# EasyEDA Pro project ProPrj_STM L_2026-07-04.epro, board PCB1
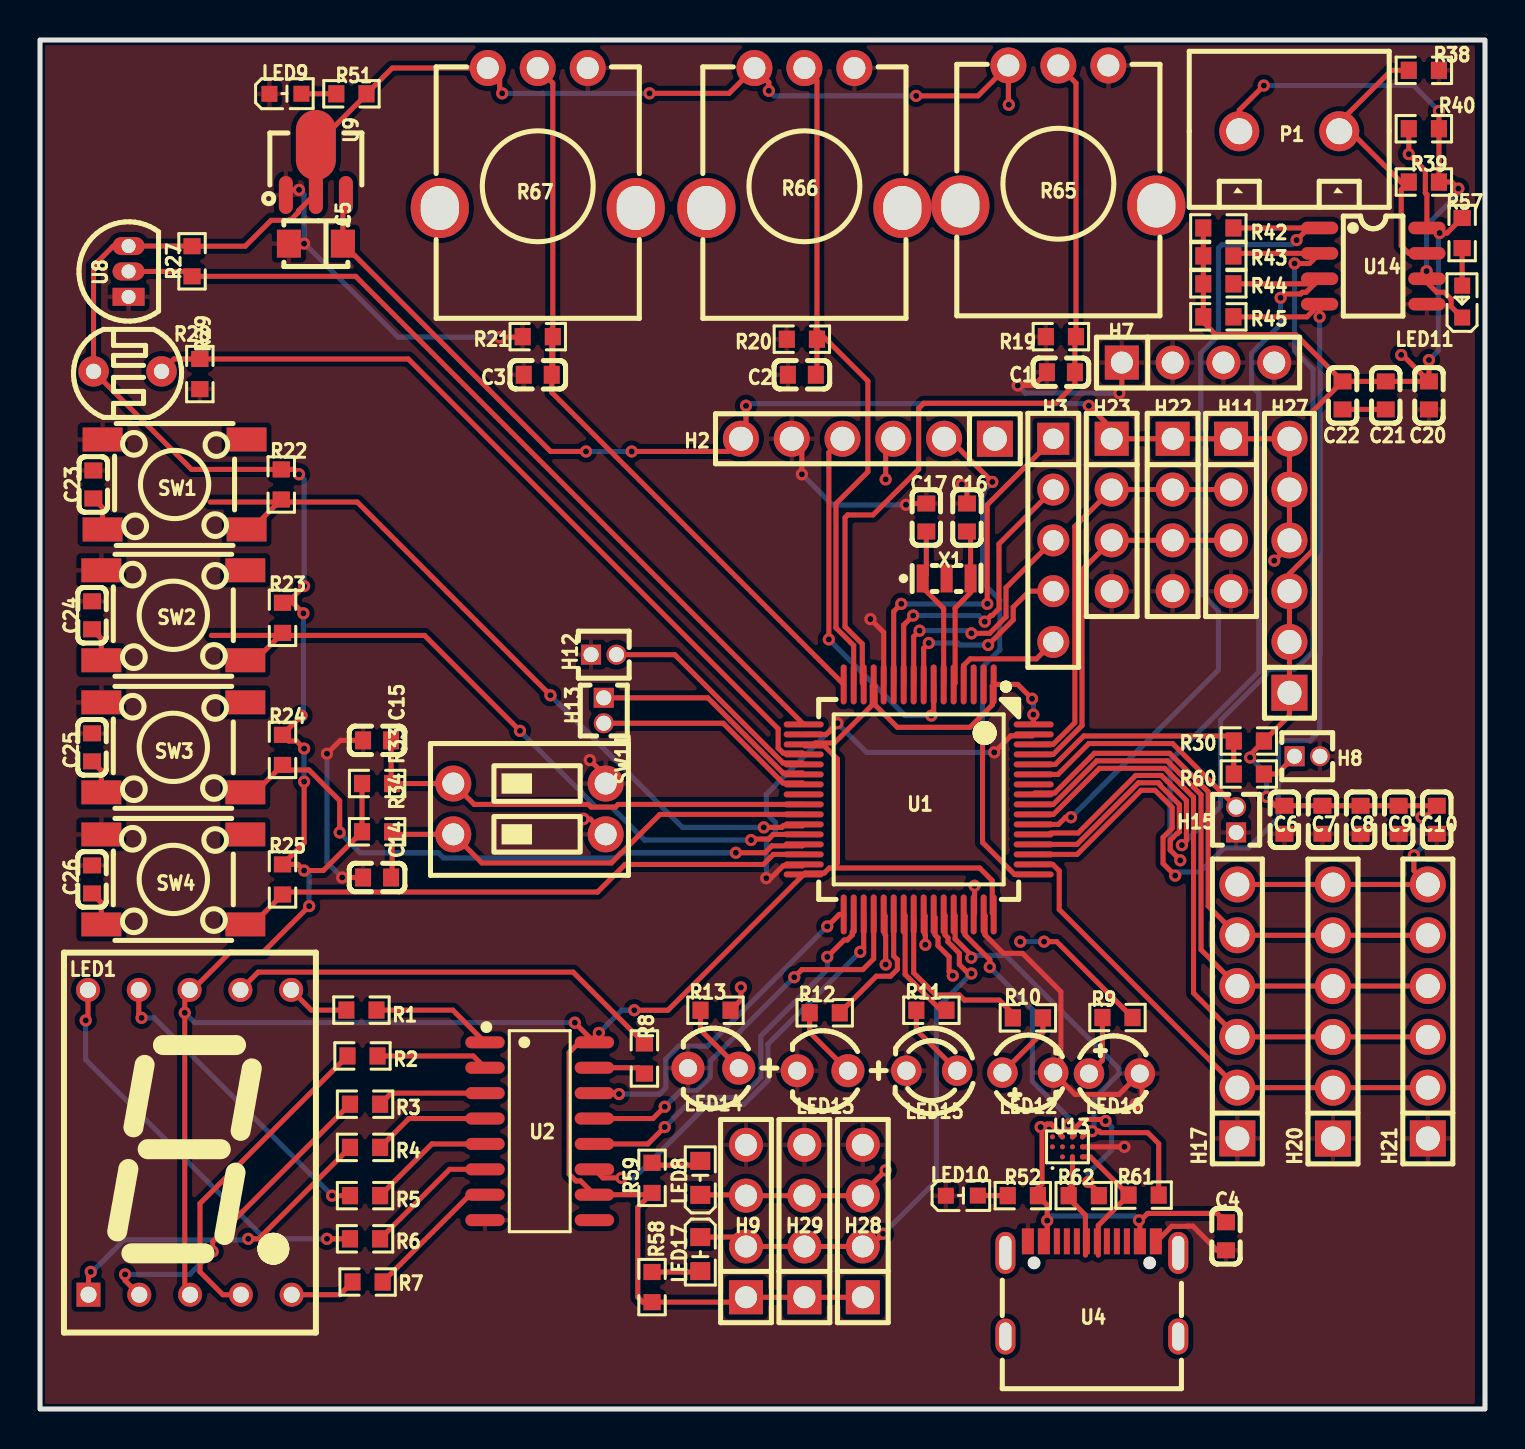
[diagram p1: board, top side]
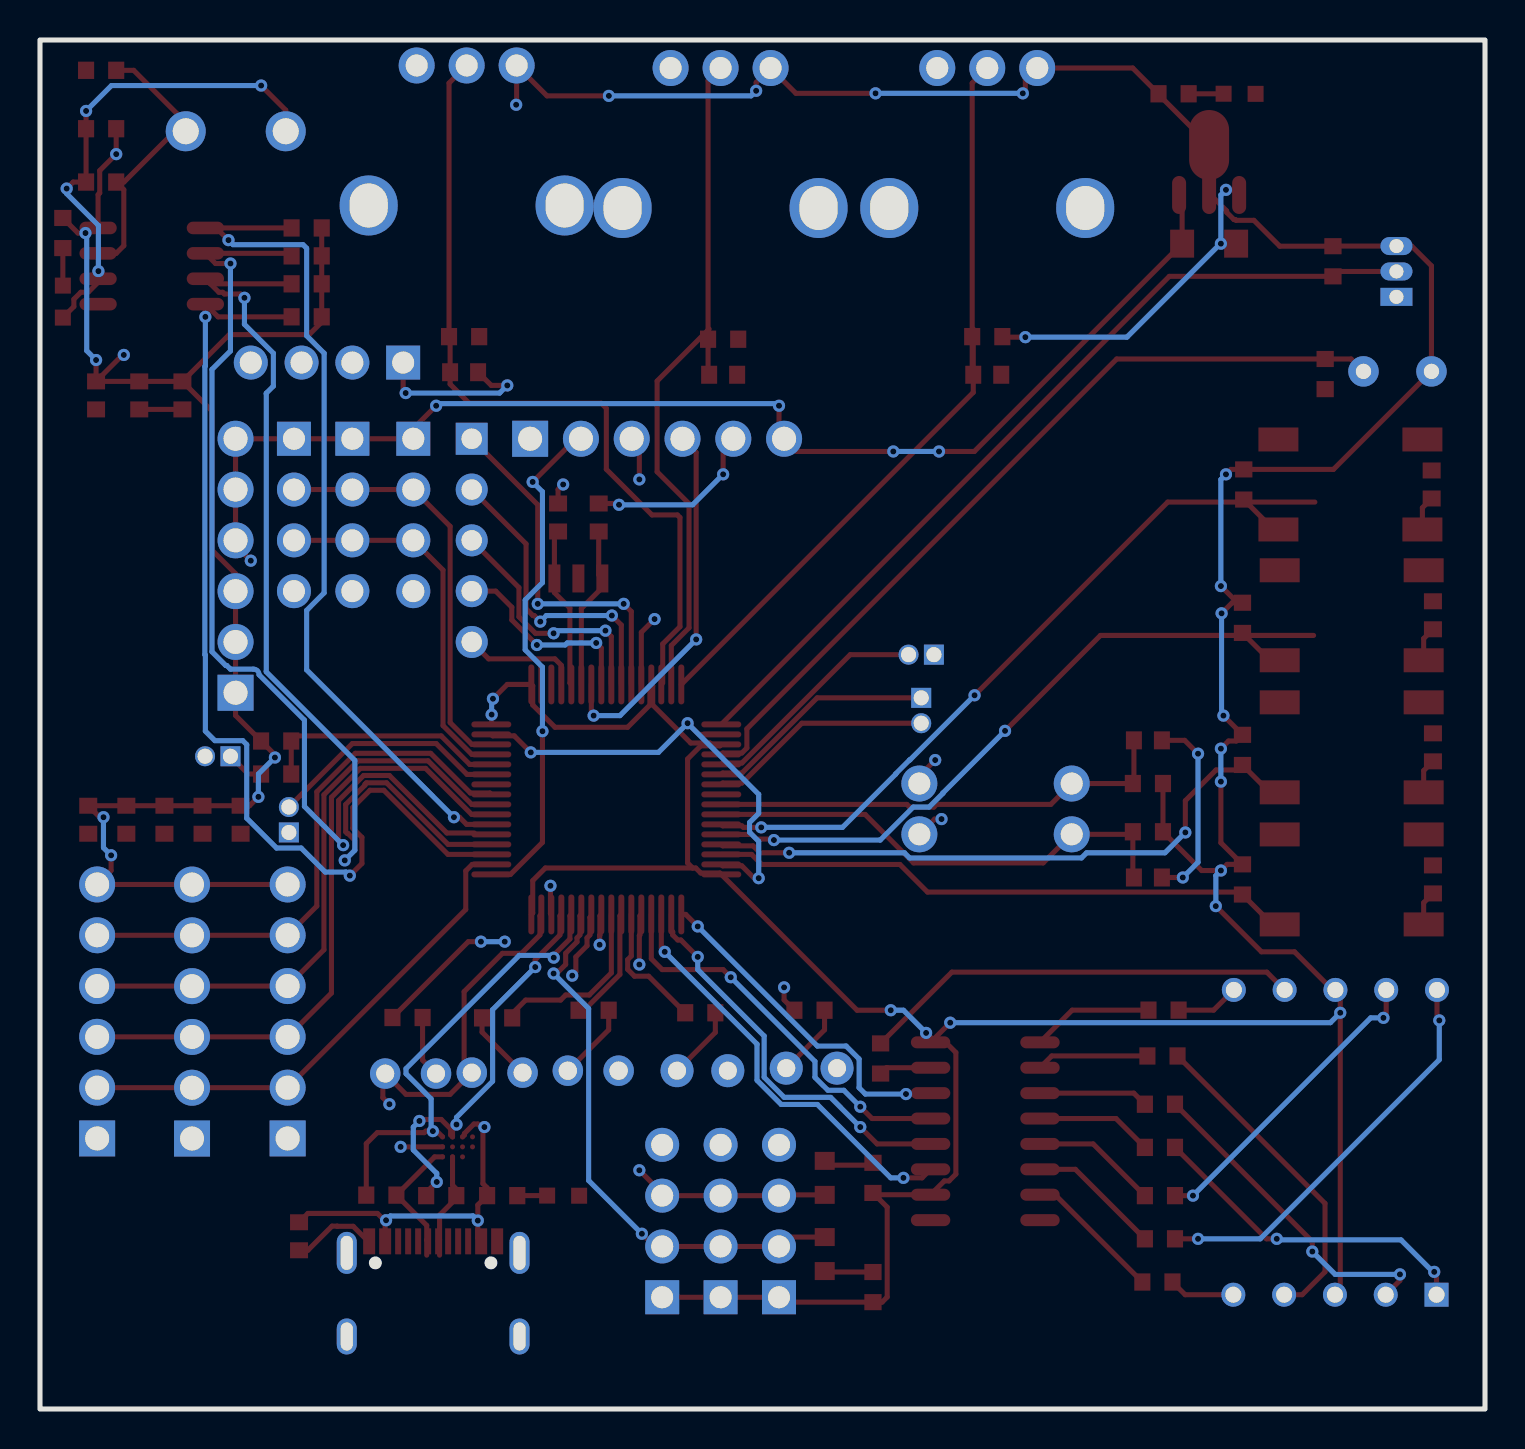
[diagram p2: board, bottom side, seen from below]

Outline 72.26 x 68.45 mm; copper layers: Top Layer, Inner1, Inner2, Bottom Layer. Coordinates in mm from the lower left corner of the outline.
Outline path: rectangle 0,68.45 72.26,0
Stack: Top Layer 0.035mm Outer layer thickness 1oz / Dielectric1 0.2104mm 7628 RC49% 8.6mil / Inner1 0.0152mm Inner layer thickness / Dielectric2 1.065mm 1.1mm H/HOZ Copper / Inner2 0.0152mm Inner layer thickness / Dielectric3 0.2104mm 7628 RC49% 8.6mil / Bottom Layer 0.035mm Outer layer thickness 1oz

## Design rules (mm)
spacing copperThickness1oz (default): track to track 0.102, other pairs 0.152 to 0.3
spacing copperThickness2oz: track to track 0.203, other pairs 0.152 to 0.3
track width copperThickness1oz (default): min 0.127, default 0.254, max 2.54
track width copperThickness2oz: min 0.203, default 0.254, max 2.54
differential pair differentialPair (default): width min 0.127, default 0.254, max 2.54; gap min 0.152, default 0.152
net GND uses copperRegion

## Placement (name value [footprint] x y rotation side)
C1  100nF  [C0603]  51.05 51.84 0 top
C2  100nF  [C0603]  38.1 51.71 0 top
C3  100nF  [C0603]  24.89 51.71 0 top
C4  100nF  [C0603]  59.31 8.64 90 top
C5  10uF  [CAP-SMD_L3.2-W1.6]  13.8 58.27 180 top
C6  100nF  [C0603]  62.23 29.46 270 top
C7  100nF  [C0603]  64.14 29.46 90 top
C8  100nF  [C0603]  66.04 29.46 270 top
C9  100nF  [C0603]  67.95 29.46 270 top
C10  100nF  [C0603]  69.85 29.46 270 top
C14  100nF  [C0603]  16.86 26.58 0 top
C15  100nF  [C0603]  16.86 33.43 0 top
C16  20pF  [C0603]  46.36 44.58 270 top
C17  20pF  [C0603]  44.32 44.58 270 top
C20  100nF  [C0603]  69.46 50.68 90 top
C21  100nF  [C0603]  67.3 50.68 270 top
C22  10uF  [C0603]  65.14 50.68 270 top
C23  100nF  [C0603]  2.67 46.23 90 top
C24  100nF  [C0603]  2.6 39.69 90 top
C25  100nF  [C0603]  2.6 33.08 90 top
C26  100nF  [C0603]  2.6 26.48 90 top
H2  2.54-1x6P直针  [HDR-TH_6P-P2.54-V-M-1]  41.4 48.51 180 top
H3  PH2.54-1X5P-H25  [HDR-TH_5P-P2.54-V-M-3]  50.67 43.43 270 top
H7  PZ2.54-1X4P-H25  [HDR-TH_4P-P2.54-V-M]  57.91 52.32 0 top
H8  1.27-1*2P针  [HDR-TH_2P-P1.27-V-M]  63.37 32.64 0 top
H9  PZ2.54-1X4P-H25  [HDR-TH_4P-P2.54-V-M]  35.31 9.4 90 top
H11  PZ2.54-1X4P-H25  [HDR-TH_4P-P2.54-V-M]  59.56 44.7 270 top
H12  1.27-1*2P针  [HDR-TH_2P-P1.27-V-M]  28.19 37.72 0 top
H13  1.27-1*2P针  [HDR-TH_2P-P1.27-V-M]  28.19 34.92 270 top
H15  1.27-1*2P针  [HDR-TH_2P-P1.27-V-M]  59.82 29.46 90 top
H17  2.54-1x6P直针  [HDR-TH_6P-P2.54-V-M-1]  59.88 19.88 90 top
H20  2.54-1x6P直针  [HDR-TH_6P-P2.54-V-M-1]  64.66 19.87 90 top
H21  2.54-1x6P直针  [HDR-TH_6P-P2.54-V-M-1]  69.4 19.88 90 top
H22  PZ2.54-1X4P-H25  [HDR-TH_4P-P2.54-V-M]  56.64 44.7 270 top
H23  PZ2.54-1X4P-H25  [HDR-TH_4P-P2.54-V-M]  53.59 44.7 270 top
H27  2.54-1x6P直针  [HDR-TH_6P-P2.54-V-M-1]  62.48 42.16 90 top
H28  PZ2.54-1X4P-H25  [HDR-TH_4P-P2.54-V-M]  41.15 9.4 90 top
H29  PZ2.54-1X4P-H25  [HDR-TH_4P-P2.54-V-M]  38.23 9.4 90 top
LED1  FJ5161BH  [LED-SEG-TH_FJ5161BH]  7.49 13.33 0 top
LED8  YLED0603R  [LED0603-FD]  33.02 11.56 270 top
LED9  NCD0603G1  [LED0603-RD_1]  12.27 65.76 0 top
LED10  NCD0603G1  [LED0603-RD_1]  46.1 10.67 0 top
LED11  KT-0603R  [LED0603-RD]  71.12 55.37 90 top
LED12  RED  [LED-TH_BD3.8-P2.54-RD]  49.4 16.82 180 top
LED13  YELLOW  [LED-TH_BD4.0-P2.54-FD]  39.14 16.92 180 top
LED14  GREEN  [LED-TH_BD4.0-P2.54-FD]  33.67 17.04 180 top
LED15  ORANGE  [LED-TH_BD3.0-P2.54-FD]  44.6 16.92 180 top
LED16  WHITE  [LED-TH_BD3.8-P2.54-FD_WHITE]  53.73 16.77 0 top
LED17  YLED0603R  [LED0603-FD]  33.02 7.75 90 top
P1  WJ126V-5.0-2P  [CONN-TH_WJ126V-5.0-2P]  62.47 63.89 90 top
R1  330Ω  [R0603]  16.08 19.94 0 top
R2  330Ω  [R0603]  16.13 17.65 0 top
R3  330Ω  [R0603]  16.26 15.24 0 top
R4  330Ω  [R0603]  16.26 13.08 0 top
R5  330Ω  [R0603]  16.26 10.67 0 top
R6  330Ω  [R0603]  16.26 8.51 0 top
R7  330Ω  [R0603]  16.38 6.35 0 top
R8  330Ω  [R0603]  30.23 17.53 90 top
R9  330Ω  [R0603]  53.88 19.57 0 top
R10  330Ω  [R0603]  49.4 19.56 180 top
R11  330Ω  [R0603]  44.58 19.94 0 top
R12  330Ω  [R0603]  39.24 19.81 0 top
R13  330Ω  [R0603]  33.78 19.94 0 top
R19  10kΩ  [R0603]  51.05 53.62 0 top
R20  10kΩ  [R0603]  38.1 53.49 0 top
R21  10kΩ  [R0603]  24.89 53.62 0 top
R22  1kΩ  [R0603]  12.07 46.23 90 top
R23  1kΩ  [R0603]  12.13 39.56 270 top
R24  1kΩ  [R0603]  12.13 32.96 270 top
R25  1kΩ  [R0603]  12.13 26.48 90 top
R27  4.7kΩ  [R0603]  7.6 57.39 90 top
R28  GL5549  [RES-TH_L5.1-W4.3-P3.40-D0.5]  4.38 51.88 90 top
R29  10kΩ  [R0603]  7.99 51.75 90 top
R30  10kΩ  [R0603]  60.45 33.4 0 top
R33  10kΩ  [R0603]  16.86 31.27 0 top
R34  10kΩ  [R0603]  16.86 28.86 0 top
R38  10kΩ  [R0603]  69.2 66.94 0 top
R39  120Ω  [R0603]  69.2 61.35 180 top
R40  10kΩ  [R0603]  69.2 64.02 0 top
R42  10kΩ  [R0603]  58.93 59.05 180 top
R43  10kΩ  [R0603]  58.93 57.66 180 top
R44  10kΩ  [R0603]  58.93 56.26 180 top
R45  10kΩ  [R0603]  58.93 54.61 180 top
R51  330Ω  [R0603]  15.57 65.76 0 top
R52  330Ω  [R0603]  49.15 10.67 0 top
R57  330Ω  [R0603]  71.12 58.8 90 top
R58  330Ω  [R0603]  30.61 6.1 270 top
R59  330Ω  [R0603]  30.61 11.56 270 top
R60  330Ω  [R0603]  60.45 31.75 0 top
R61  22Ω  [R0603]  55.19 10.69 0 top
R62  22Ω  [R0603]  52.2 10.67 0 top
R65  10kΩ  [RES-ADJ-TH_RK09K1130AJ3]  50.93 63.68 180 top
R66  10kΩ  [RES-ADJ-TH_RK09K1130AJ3]  38.23 63.55 180 top
R67  10kΩ  [RES-ADJ-TH_RK09K1130AJ3]  24.89 63.55 180 top
SW1  LXW-TS-6X6X5-SMD  [SW-SMD_4P-L6.0-W6.0-P4.50-LS7.2]  6.73 46.23 0 top
SW2  LXW-TS-6X6X5-SMD  [SW-SMD_4P-L6.0-W6.0-P4.50-LS7.2]  6.67 39.69 0 top
SW3  LXW-TS-6X6X5-SMD  [SW-SMD_4P-L6.0-W6.0-P4.50-LS7.2]  6.67 33.08 0 top
SW4  LXW-TS-6X6X5-SMD  [SW-SMD_4P-L6.0-W6.0-P4.50-LS7.2]  6.67 26.48 0 top
SW11  DS-02-R-T  [SW-TH_4P-P2.54_DS-02R]  24.48 30 270 top
U1  STM32L073RBT6  [LQFP-64_L10.0-W10.0-P0.50-LS12.0-BL]  43.94 30.48 180 top
U2  74HC595D  [SOIC-16_L9.9-W3.9-P1.27-LS6.0-BL]  24.99 13.89 270 top
U4  USB-TYPE-C-017  [USB-TYPE-C-SMD_C9900008089]  52.6 6.01 0 top
U8  DS18B20+  [TO-92-3_L4.9-W3.7-P1.27-L]  4.43 56.88 90 top
U9  AMS1117S-3.3  [SOT-89-3_L4.5-W2.5-P1.50-LS4.1-BR]  13.8 61.95 270 top
U13  20pF  [BGA-11_L2.0-W1.4-P0.50-TL]  51.38 13.11 90 top
U14  RS485  [SOP-8_L4.9-W3.9-P1.27-LS6.0-BL]  66.67 57.15 270 top
X1  8MHz  [OSC-SMD_3P-L3.2-W1.3-P1.20-L]  45.34 41.53 0 top

## Footprints (pads in the part's own frame, mm; a bottom-side part is the same pattern mirrored in y, then rotated)
BGA-11_L2.0-W1.4-P0.50-TL
  round 0.252 smd: A2(0,0.75) A3(0.5,0.75) B1(-0.5,0.25) B2(0,0.25) B3(0.5,0.25) C1(-0.5,-0.25) C2(0,-0.25) C3(0.5,-0.25) D1(-0.5,-0.75) D2(0,-0.75) D3(0.5,-0.75)
C0603
  rect 0.8x0.9 smd: 1(-0.7,0) 2(0.7,0)
CAP-SMD_L3.2-W1.6
  rect 1.2x1.4 smd: 1(-1.35,0) 2(1.35,0)
CONN-TH_WJ126V-5.0-2P
  round 2 hole 1.3: 1(0,2.501) 2(0,-2.501)
HDR-TH_2P-P1.27-V-M
  rect 1x1 hole 0.75: 1(-0.635,0)
  round 1 hole 0.75: 2(0.635,0)
HDR-TH_4P-P2.54-V-M
  rect 1.7x1.7 hole 1.1: 1(-3.81,0)
  round 1.7 hole 1.1: 2(-1.27,0) 3(1.27,0) 4(3.81,0)
HDR-TH_5P-P2.54-V-M-3
  rect 1.6x1.6 hole 1.02: 1(-5.08,0)
  round 1.6 hole 1.02: 2(-2.54,0) 3(0,0) 4(2.54,0) 5(5.08,0)
HDR-TH_6P-P2.54-V-M-1
  rect 1.8x1.8 hole 1.2: 1(-6.35,0)
  round 1.8 hole 1.2: 2(-3.81,0) 3(-1.27,0) 4(1.27,0) 5(3.81,0) 6(6.35,0)
LED0603-FD
  rect 0.9x1 smd: 1(-0.85,0) 2(0.85,0)
LED0603-RD
  rect 0.8x0.8 smd: 1(-0.799,0) 2(0.799,0)
LED0603-RD_1
  rect 0.8x0.8 smd: 1(-0.799,-0.004) 2(0.799,0.004)
LED-SEG-TH_FJ5161BH
  rect 1.2x1.2 hole 0.8: 1(-5.067,-7.62)
  round 1.2 hole 0.8: 2(-2.527,-7.62) 3(0.013,-7.62) 4(2.553,-7.62) 5(5.093,-7.62) 6(5.067,7.62) 7(2.527,7.62) 8(-0.013,7.62) 9(-2.553,7.62) 10(-5.093,7.62)
LED-TH_BD3.0-P2.54-FD
  round 1.524 hole 0.914: 1(-1.27,0) 2(1.27,0)
LED-TH_BD3.8-P2.54-FD_WHITE
  round 1.524 hole 0.9: 1(-1.27,0) 2(1.27,0)
LED-TH_BD3.8-P2.54-RD
  round 1.524 hole 0.9: 1(-1.27,0) 2(1.27,0)
LED-TH_BD4.0-P2.54-FD
  round 1.651 hole 0.9: 1(-1.27,0) 2(1.27,0)
LQFP-64_L10.0-W10.0-P0.50-LS12.0-BL
  oval 0.3x2 smd: 1(-3.75,-5.75) 2(-3.25,-5.75) 3(-2.75,-5.75) 4(-2.25,-5.75) 5(-1.75,-5.75) 6(-1.25,-5.75) 7(-0.75,-5.75) 8(-0.25,-5.75) 9(0.25,-5.75) 10(0.75,-5.75) 11(1.25,-5.75) 12(1.75,-5.75) 13(2.25,-5.75) 14(2.75,-5.75) 15(3.25,-5.75) 16(3.75,-5.75) 33(3.75,5.75) 34(3.25,5.75) 35(2.75,5.75) 36(2.25,5.75) 37(1.75,5.75) 38(1.25,5.75) 39(0.75,5.75) 40(0.25,5.75) 41(-0.25,5.75) 42(-0.75,5.75) 43(-1.25,5.75) 44(-1.75,5.75) 45(-2.25,5.75) 46(-2.75,5.75) 47(-3.25,5.75) 48(-3.75,5.75)
  oval 2x0.3 smd: 17(5.75,-3.75) 18(5.75,-3.25) 19(5.75,-2.75) 20(5.75,-2.25) 21(5.75,-1.75) 22(5.75,-1.25) 23(5.75,-0.75) 24(5.75,-0.25) 25(5.75,0.25) 26(5.75,0.75) 27(5.75,1.25) 28(5.75,1.75) 29(5.75,2.25) 30(5.75,2.75) 31(5.75,3.25) 32(5.75,3.75) 49(-5.75,3.75) 50(-5.75,3.25) 51(-5.75,2.75) 52(-5.75,2.25) 53(-5.75,1.75) 54(-5.75,1.25) 55(-5.75,0.75) 56(-5.75,0.25) 57(-5.75,-0.25) 58(-5.75,-0.75) 59(-5.75,-1.25) 60(-5.75,-1.75) 61(-5.75,-2.25) 62(-5.75,-2.75) 63(-5.75,-3.25) 64(-5.75,-3.75)
OSC-SMD_3P-L3.2-W1.3-P1.20-L
  rect 0.6x1.4 smd: 1(-1.199,0) 2(0,0) 3(1.199,0)
R0603
  rect 0.806x0.864 smd: 1(-0.753,0) 2(0.753,0)
RES-ADJ-TH_RK09K1130AJ3
  round 1.8 hole 1.1: 1(-2.5,-3.5) 2(0,-3.5) 3(2.5,-3.5)
  oval 2.9x3 hole 1.9x2.2: 4(-4.9,3.5) 5(4.9,3.5)
RES-TH_L5.1-W4.3-P3.40-D0.5
  round 1.524 hole 0.762: 1(0,1.7) 2(0,-1.7)
SOIC-16_L9.9-W3.9-P1.27-LS6.0-BL
  oval 0.602x1.971 smd: 1(-4.445,-2.736) 2(-3.175,-2.736) 3(-1.905,-2.736) 4(-0.635,-2.736) 5(0.635,-2.736) 6(1.905,-2.736) 7(3.175,-2.736) 8(4.445,-2.736) 9(4.445,2.736) 10(3.175,2.736) 11(1.905,2.736) 12(0.635,2.736) 13(-0.635,2.736) 14(-1.905,2.736) 15(-3.175,2.736) 16(-4.445,2.736)
SOP-8_L4.9-W3.9-P1.27-LS6.0-BL
  oval 0.63x1.865 smd: 1(-1.905,-2.683) 2(-0.635,-2.683) 3(0.635,-2.683) 4(1.905,-2.683) 5(1.905,2.683) 6(0.635,2.683) 7(-0.635,2.683) 8(-1.905,2.683)
SOT-89-3_L4.5-W2.5-P1.50-LS4.1-BR
  oval 1.9x0.7 smd: 1(1.25,-1.501) 3(1.25,1.501)
  oval 3.5x2 smd: 2(-1.25,0)
  oval 2.1x0.7 smd: 2(1.151,0)
SW-SMD_4P-L6.0-W6.0-P4.50-LS7.2
  rect 2x1.2 smd: 1(-3.6,2.25) 2(3.6,2.25) 3(-3.6,-2.25) 4(3.6,-2.25)
SW-TH_4P-P2.54_DS-02R
  round 1.8 hole 1.1: 1(-1.27,3.81) 2(1.27,3.81) 3(1.27,-3.81) 4(-1.27,-3.81)
TO-92-3_L4.9-W3.7-P1.27-L
  rect 0.9x1.6 hole 0.7: 1(-1.27,0)
  oval 0.9x1.6 hole 0.7: 2(0,0) 3(1.27,0)
USB-TYPE-C-SMD_C9900008089
  oval 1x2.1 hole 0.6x1.7: 1(-4.32,1.801) 2(4.32,1.801)
  oval 1x1.8 hole 0.6x1.4: 3(-4.32,-2.379) 4(4.32,-2.379)
  rect 0.6x1.3 smd: A1B12(-3.2,2.379) A4B9(-2.4,2.379) B1A12(3.2,2.379) B4A9(2.4,2.379)
  rect 0.3x1.3 smd: A5(-1.25,2.379) A6(-0.25,2.379) A7(0.25,2.379) A8(1.25,2.379) B5(1.75,2.379) B6(0.75,2.379) B7(-0.75,2.379) B8(-1.75,2.379)

## Nets
As in the schematic.

Pads without a net: H2 1; R65 4 5; R66 4 5; R67 4 5; SW1 2; SW2 2; SW3 2; SW4 2; U1 2 3 24 58; U2 9; U4 1 2 3 4 A5 A8 B5 B6 B7 B8; U13 A2 A3 B1 B2 C2; X1 2

## Via types
v1: diameter 0.61, hole 0.305, Top Layer to Bottom Layer, 116 vias

## Routing (per net, layer and track width the routed paths; a pad name or vN(x,y) marks a point on that pad's centre or on a via; arc(x,y) is an arc through that point)
+3.3V: length 332.2
  Top Layer w0.254: 59.88,26.23 64.66,26.23 H20.6 64.66,26.23 69.4,26.23 68.71,26.92 v1(68.71,27.69) ; v1(68.07,52.7) 68.14,52.7 C20.2 ; R42.2 R43.2 R44.2 R45.2 58.17,54.35 58.8,53.72 62.8,53.72 C22.1 ; 30.52,10.71 U2.10 27.04,11.4 26.8,11.4 26.46,11.74 26.46,17.83 26.8,18.16 ; 30.52,10.71 R59.2 ; 30.52,10.71 29.9,10.09 29.9,5.6 30.15,5.34 R58.2 35.06,5.34 H9.1 H29.1 H28.1 ; C20.2 C21.1 C22.1 ; C20.2 v1(69.46,52.45) ; v1(12.95,46.74) 12.71,46.98 R22.2 7.58,46.98 2.68,51.88 2.68,57.16 3.67,58.15 U8.3 7.6,58.15 R27.2 10.26,58.14 11.56,59.44 12.45,59.44 12.48,59.47 12.56,59.47 12.92,59.84 12.92,59.91 13.8,60.79 U9.2 ; v1(29.72,19.94) 31.4,19.94 U1.32 38.26,26.8 39.22,26.8 39.47,27.05 39.62,27.05 ; v1(27.95,18.81) 27.73,18.58 U2.16 v1(26.74,19.32) ; 12.37,40.31 R23.1 ; 12.37,40.31 12.65,40.31 v1(13.17,39.79) ; 12.37,40.31 v1(13.21,41.15) ; v1(13.21,33.02) 12.83,33.4 12.44,33.4 R24.1 12.13,33.72 v1(13.08,34.67) ; 16.33,65.76 17.62,67.05 R67.3 22.99,66.46 22.99,65.91 v1(23.11,65.79) ; v1(30.48,65.79) 34.46,65.79 R66.3 36.45,66.33 v1(36.45,65.91) ; C22.1 63.66,49.9 63.66,42.95 62.48,41.77 H27.3 H27.2 H27.1 62.48,34.68 R30.2 60.52,32.71 v1(60.52,32.58) ; R57.2 70.37,58.8 v1(69.99,58.8) 69.74,59.05 U14.8 69.36,60.72 69.28,60.8 69.28,61.92 v1(68.45,62.75) R40.1 ; v1(43.82,65.66) 46.91,65.66 R65.3 48.43,65.24 v1(48.45,65.21) ; 39.62,27.05 39.88,27.3 39.88,32.5 39.22,33.16 38.26,33.16 U1.19 38.69,33.23 38.76,33.3 39.72,33.3 41.62,35.2 41.62,36.16 U1.13 41.76,36.16 41.76,35.2 42.88,34.09 46.51,34.09 47.62,35.2 47.62,36.16 U1.1 48.89,36.23 v1(49.61,35.51) ; 39.62,27.05 46.99,27.05 47.62,26.42 47.62,24.8 U1.48 ; LED1.3 7.24,5.98 v1(7.24,19.81) 7.24,20.71 LED1.8 7.62,20.95 9.53,22.86 11.18,22.86 v1(13.46,25.15) ; v1(13.21,31.37) 13.21,28.31 R25.2 12.9,27.23 v1(13.21,26.92) 14.17,26.92 16.1,28.86 16.1,31.27 ; v1(69.09,29.59) 69.28,29.59 C10.1 C9.1 C8.1 C7.2 C6.1 61.78,30.16 v1(61.34,30.61) ; U1.64 49.68,34.24 v1(49.68,34.72) ; U9.2 16.33,65.73
  Inner2 w0.254: v1(68.07,52.7) 67.82,52.7 67.57,52.95 67.57,54.73 60.33,61.98 51.69,61.98 v1(48.45,65.21)
  Bottom Layer w0.254: v1(13.17,39.79) 13.17,34.76 v1(13.08,34.67) ; v1(12.95,46.74) 13.21,46.48 v1(13.21,41.15) ; v1(43.82,65.66) 36.7,65.66 v1(36.45,65.91) ; v1(26.74,19.32) 7.73,19.32 v1(7.24,19.81) ; v1(68.71,27.69) 69.09,28.07 v1(69.09,29.59) ; v1(49.61,35.51) 49.68,35.45 v1(49.68,34.72) ; v1(13.21,31.37) v1(13.21,33.02) ; v1(13.46,25.15) 13.46,26.67 v1(13.21,26.92) ; v1(23.11,65.79) v1(30.48,65.79) ; v1(61.34,30.61) 61.34,31.75 v1(60.52,32.58) ; v1(29.72,19.94) 29.08,19.94 v1(27.95,18.81) ; v1(69.99,58.8) 69.93,58.74 69.93,52.92 v1(69.46,52.45)
+5V: length 115.2
  Top Layer w0.254: v1(52.45,50.16) 53.59,49.02 H23.1 H22.1 H11.1 H27.6 H27.5 H27.4 62.48,43.18 v1(61.72,42.42) ; C4.2 58.87,9.78 55.39,9.78 55,9.39 ; U9.3 15.15,60.55 C5.1 25.54,47.88 v1(27.3,47.88) ; v1(35.31,50.16) 35.31,48.77 H2.6 34.42,47.88 v1(29.59,47.88) ; 55,9.39 v1(54.96,9.44) ; 55,9.39 U4.B4A9 ; U4.A4B9 50.37,8.55 v1(50.37,9.42) 50.37,10.2 R52.2 49.9,11.06 50.11,11.27 50.11,14 50.37,14.25 50.56,14.25 51.04,13.78 51.04,13.7 U13.B3 ; 50.03,13.98 50.03,14.09 v1(50.04,14.1)
  Inner2 w0.254: v1(61.72,42.42) 61.72,42.04 60.69,41.01 60.69,40.43 60.03,39.76 59.45,39.76 49.63,29.94 49.63,16.39 50.04,15.98 v1(50.04,14.1)
  Bottom Layer w0.254: v1(54.96,9.44) 54.74,9.65 50.6,9.65 v1(50.37,9.42) ; v1(35.31,50.16) 35.41,50.27 52.34,50.27 v1(52.45,50.16) ; v1(27.3,47.88) v1(29.59,47.88)
GND: length 118.9
  Top Layer w0.254: SW11.2 27.53,29.5 v1(27.18,29.5) ; v1(41.53,39.5) 42.19,38.83 U1.12 ; v1(48.89,51.18) 49.69,51.18 C1.1 ; H2.5 38.1,48.01 v1(38.1,46.74) ; 66.03,28.75 C8.2 66.05,28.77 ; v1(54.79,15.24) 55.12,15.57 55.12,16.65 LED16.2 53.96,15.73 51.76,15.73 LED12.1 51.05,17.2 51.05,20.87 49.14,22.78 48.18,22.78 47.26,23.7 47.26,24.66 U1.47 ; U4.B1A12 55.85,8.38 56.6,9.14 57.4,9.14 57.4,9.14 57.66,9.14 58.87,7.94 C4.1 ; 67.93,28.77 C9.2 ; U1.31 38.12,27.16 37.16,27.16 36.55,26.54 v1(36.32,26.54) ; C16.1 46.36,45.97 v1(46.1,46.23) ; C14.1 v1(15.11,26.58) ; v1(27.5,32.45) 28.29,31.66 SW11.1 ; v1(47.72,32.83) 48.55,33.66 49.62,33.66 U1.63 ; v1(53.98,50.8) 54.1,50.93 H7.1 ; v1(22.99,53.59) 24.11,53.59 R21.1 ; C7.1 64.14,28.75 ; U9.1 12.55,60.96 v1(12.95,60.96) ; C15.1 15.02,33.43 v1(14.35,32.77) ; v1(39.88,34.29) 39.32,33.73 U1.18 ; C17.1 43.37,45.28 v1(43.31,45.21) ; 52.13,13.11 v1(54.23,13.11) ; C5.2 v1(13.21,58.27)
  Inner2 w0.254: v1(27.5,32.45) 26.92,31.88 26.92,29.75 v1(27.18,29.5) ; v1(46.1,46.23) 46.39,46.52 46.39,50.67 46.57,50.85 48.57,50.85 v1(48.89,51.18) ; v1(54.23,13.11) 54.61,13.11 54.79,13.29 v1(54.79,15.24) ; v1(41.53,39.5) 39.88,37.85 v1(39.88,34.29)
  Bottom Layer w0.254: v1(38.1,46.74) 39.62,45.21 v1(43.31,45.21) ; v1(36.32,26.54) 36.32,28.38 36.78,28.84 36.78,29.32 36.32,29.78 36.32,30.73 v1(39.88,34.29) 41.34,32.83 v1(47.72,32.83) ; v1(12.95,60.96) 13.21,60.71 v1(13.21,58.27) 13.23,58.27 17.91,53.59 v1(22.99,53.59) ; v1(15.11,26.58) 14.35,27.34 v1(14.35,32.77) ; v1(48.89,51.18) 49.28,50.8 v1(53.98,50.8)
BOOT0: length 12.4
  Top Layer w0.254: R60.1 R30.1 59.44,33.65 52.2,33.65 50.77,32.23 U1.60
D+: length 20.2
  Top Layer w0.254: U1.45 46.26,24.66 46.26,23.7 47.5,22.47 v1(47.5,22.1) ; v1(51.44,14.22) 51.63,14.03 U13.C3 51.73,13.7 51.73,14.01 52.2,14.48 53.21,14.48 v1(53.29,14.4) ; v1(52.42,11.35) 52.95,10.82 R62.2
  Bottom Layer w0.254: v1(53.29,14.4) 53.59,14.1 53.59,12.95 52.42,11.78 v1(52.42,11.35) ; v1(51.44,14.22) 51.44,14.58 49.63,16.39 49.63,19.97 v1(47.5,22.1)
D+IN: length 5.5
  Top Layer w0.254: 52.28,8.46 52.28,7.69 ; 52.28,8.46 52.28,9.69 51.39,10.59 51.39,10.95 51.63,11.19 U13.C1 ; 52.28,8.46 U4.A6
D-: length 22.6
  Top Layer w0.254: U13.D3 52.42,13.89 v1(52.62,13.89) 52.97,13.89 53.05,13.82 55.4,13.82 55.95,13.27 R61.2 ; 46.64,22.63 45.76,23.5 45.76,24.66 U1.44
  Bottom Layer w0.254: v1(52.62,13.89) 52.7,13.98 52.7,15.51 53.96,16.76 53.96,17.02 48.29,22.68 46.69,22.68 46.64,22.63
  vias: v1(46.57,22.57)
D-IN: length 6.8
  Top Layer w0.254: U13.D1 52.53,12.61 R61.1 52.92,9.18 52.92,8.46 ; 52.92,8.46 U4.A7 ; 52.92,8.46 52.92,7.69
NRST: length 18.6
  Top Layer w0.254: v1(39.45,38.48) 39.45,47.83 H2.4 ; v1(44.58,34.67) 44.69,34.79 U1.7
  Bottom Layer w0.254: v1(44.58,34.67) 43.26,34.67 v1(39.45,38.48)
PA0: length 40.9
  Top Layer w0.254: 51.75,53.57 C1.2 51.75,51.25 50.8,50.29 44.2,50.29 43.94,50.04 43.94,46.99 41.66,44.7 40.39,44.7 40.26,44.58 40.26,39.12 41.12,38.25 41.12,36.3 ; R19.2 51.81,66.3 R65.2
PA1: length 35.5
  Top Layer w0.254: R66.2 38.85,66.43 38.85,53.95 ; 38.85,53.95 41.4,51.4 41.4,46.86 39.8,45.27 39.8,39.06 40.69,38.17 U1.15 ; 38.85,53.95 R20.2 38.85,51.77 C2.2 ; 38.85,53.95 38.8,54
PA2: length 39.5
  Top Layer w0.254: U1.16 25.59,50.83 C3.2 ; R67.2 25.65,66.3 R21.2 25.65,51.77 C3.2 ; C3.2 25.59,54
PA3: length 43.1
  Top Layer w0.254: U1.17 15.79,56.63 R27.1 7.36,56.88 U8.2
PA4: length 41.1
  Top Layer w0.254: R28.2 6.7,52.5 R29.2 18.42,52.5 36.91,34.01 36.91,33.05 37.16,32.8 38.12,32.8 U1.20
PA5: length 11.6
  Top Layer w0.254: H12.2 31.74,37.72 37.16,32.3 38.12,32.3 U1.21
PA6: length 11.6
  Top Layer w0.254: U1.22 38.12,31.8 37.16,31.8 33.4,35.56 H13.1
PA7: length 11.3
  Top Layer w0.254: H13.2 34.17,34.29 37.15,31.3 38.12,31.3 U1.23
PA8: length 13.5
  Top Layer w0.254: v1(44.28,23.21) 44.28,23.69 44.26,23.7 44.26,24.66 U1.41 ; v1(50.21,23.37) 50.84,23.37 R9.2
  Inner2 w0.254: v1(44.28,23.21) 44.43,23.37 v1(49.02,23.37)
  Bottom Layer w0.254: v1(49.02,23.37) v1(50.21,23.37)
PA9: length 24.4
  Top Layer w0.254: v1(45.65,21.67) 45.47,21.85 45.47,22.61 44.91,23.16 44.91,23.56 44.76,23.7 44.76,24.58 44.7,24.64 ; v1(42.29,11.94) 41.15,10.79 41.15,10.67 35.31,10.67 35.27,10.71 LED8.2
  Inner2 w0.254: v1(42.29,11.94) 42.28,11.95 42.28,17.34 42.29,17.35 42.29,18.31 v1(45.65,21.67)
PA10: length 28.1
  Top Layer w0.254: LED17.2 34.84,8.6 H9.2 H29.2 H28.2 41.53,8.13 v1(42.16,8.76) ; U1.43 45.26,24.66 45.26,23.7 45.41,23.56 45.41,23.36 45.97,22.79 45.97,22.23 46.43,21.78 v1(46.58,21.78)
  Bottom Layer w0.254: v1(46.58,21.78) 44.83,20.02 44.83,11.42 v1(42.16,8.76)
PA13: length 25.8
  Top Layer w0.254: U1.46 46.74,24.77 v1(46.74,26.16) ; H2.3 42.29,48.13 v1(42.29,46.48)
  Inner2 w0.254: v1(46.74,26.16) 42.29,30.61 v1(42.29,46.48)
PA14: length 25.5
  Top Layer w0.254: v1(47.14,33.89) 47.14,28.33 48.73,26.73 U1.49 ; v1(47.63,46.35) 45.47,48.51 H2.2
  Bottom Layer w0.254: v1(47.63,46.35) 47.14,45.87 47.14,41.32 48,40.46 48,37.96 47.14,37.1 v1(47.14,33.89)
PA15: length 25.5
  Top Layer w0.254: 69.4,16.07 64.66,16.07 H20.2 64.66,16.07 59.88,16.07 50.97,24.98 50.97,26.91 50.65,27.23 U1.50
PB0: length 24.5
  Top Layer w0.254: C14.2 17.61,26.63 R34.2 17.74,28.73 SW11.3 22.1,27.3 28.58,27.3 31,29.73 U1.26
PB1: length 38.8
  Top Layer w0.254: SW1.4 10.57,43.98 11.94,45.35 ; 11.94,45.35 15.87,45.35 v1(25.53,35.69) ; 11.94,45.35 8.51,45.35 ; 11.94,45.35 R22.1 ; v1(36.2,29.08) 37.09,29.08 37.16,29.16 38.12,29.16 U1.27
  Bottom Layer w0.254: v1(25.53,35.69) 28.76,32.45 28.78,32.45 29.47,31.76 29.47,31.75 32.13,29.08 v1(36.2,29.08)
PB2: length 36.4
  Top Layer w0.254: SW2.4 10.76,37.44 12,38.68 ; v1(24,33.91) 19.23,38.68 12,38.68 ; v1(35.56,28.45) 35.61,28.5 36.44,28.5 36.67,28.73 37.24,28.73 37.24,28.73 U1.28 ; 12,38.68 R23.2 ; 12,38.68 8.57,38.68
  Bottom Layer w0.254: v1(35.56,28.45) 30.24,28.45 28.59,30.1 27.8,30.1 27.11,30.79 27.11,30.8 v1(24,33.91)
PB3: length 32
  Top Layer w0.254: H21.3 64.66,18.61 H20.3 64.66,18.61 H17.3 57.69,20.8 57.69,30.59 56.24,32.03 52.98,32.03 50.68,29.73 U1.55
PB4: length 29.8
  Top Layer w0.254: U1.56 50.67,30.23 52.85,32.41 56.37,32.41 58.06,30.71 58.06,22.96 59.88,21.15 64.66,21.15 H20.4 64.66,21.15 69.4,21.15
PB5: length 27.7
  Top Layer w0.254: U1.57 49.76,30.8 50.74,30.8 52.73,32.79 56.49,32.79 58.42,30.86 58.42,25.15 H17.5 64.66,23.69 H20.5 64.66,23.69 H21.5
PB7: length 12.1
  Top Layer w0.254: U1.59 50.91,31.73 52.45,33.27 56.64,33.27 H15.2
PB8: length 18.9
  Top Layer w0.254: H11.3 H22.3 H23.3 52.11,41.95 52.11,34.17 50.67,32.73 U1.61
PB9: length 20.9
  Top Layer w0.254: H11.2 H22.2 H23.2 51.75,44.13 51.75,34.32 50.66,33.23 U1.62
PB10: length 31.6
  Top Layer w0.254: v1(34.8,27.81) 36.25,27.81 36.6,28.16 38.12,28.16 U1.29 ; v1(14.99,28.83) 14.99,30.42 13.45,31.95 12.38,31.95 R24.2 10.76,30.83 SW3.4
  Bottom Layer w0.254: v1(14.99,28.83) 16,27.81 19.92,27.81 20.18,27.56 28.78,27.56 29.03,27.81 v1(34.8,27.81)
PB11: length 29.6
  Top Layer w0.254: 12.25,25.85 27.88,25.85 29.26,27.23 36.17,27.23 36.67,27.73 U1.30 ; 12.25,25.85 12.38,25.97 ; 12.25,25.85 R25.1 10.63,24.23 SW4.4
PB12: length 20
  Top Layer w0.254: v1(31.24,15.11) 30.65,14.52 U2.13 ; U1.36 41.69,22.51 41.15,21.97 38.1,21.97 v1(37.72,21.59)
  Bottom Layer w0.254: v1(37.72,21.59) 33.51,17.38 33.51,16.59 32.86,15.94 32.07,15.94 v1(31.24,15.11)
PB13: length 21.2
  Top Layer w0.254: U1.35 41.19,23.03 v1(41.02,22.86) ; U2.11 28.15,11.56 v1(29.08,11.56)
  Bottom Layer w0.254: v1(41.02,22.86) 36.41,18.24 36.41,16.44 35.19,15.23 33.39,15.23 29.72,11.56 v1(29.08,11.56)
PB14: length 19.9
  Top Layer w0.254: U1.34 40.69,23.93 40.62,23.86 40.62,23.7 40.37,23.45 40.22,23.45 v1(39.37,22.61) ; U2.12 30.4,13.25 v1(31.24,14.1)
  Bottom Layer w0.254: v1(31.24,14.1) 32.73,15.58 35.05,15.58 36.05,16.59 36.05,18.65 39.37,21.97 v1(39.37,22.61)
PB15: length 17
  Top Layer w0.254: U1.33 39.97,24.73 v1(39.37,24.13) ; v1(28.96,15.75) 28.91,15.79 U2.14
  Bottom Layer w0.254: v1(39.37,24.13) 33.39,18.15 31.95,18.15 31.3,17.5 31.3,16.06 30.99,15.75 v1(28.96,15.75)
PC0: length 9.9
  Top Layer w0.254: v1(44.45,38.3) 44.19,38.05 U1.8 ; H3.4 49.47,40.89 48.67,40.09 48.67,39.45 v1(47.41,38.2)
  Bottom Layer w0.254: v1(47.41,38.2) 46,38.2 45.9,38.3 v1(44.45,38.3)
PC1: length 12.3
  Top Layer w0.254: v1(43.99,38.92) 43.69,38.62 U1.9 ; H3.3 48.31,41.07 48.31,39.61 47.49,38.79 v1(46.58,38.79)
  Bottom Layer w0.254: v1(43.99,38.92) 46.45,38.92 v1(46.58,38.79)
PC2: length 15.4
  Top Layer w0.254: v1(47.24,39.37) 47.55,39.67 47.61,39.67 47.95,40.02 47.95,43.26 50.67,45.97 ; U1.10 43.19,39.2 v1(43.67,39.67)
  Bottom Layer w0.254: v1(47.24,39.37) 46.94,39.67 v1(43.67,39.67)
PC3: length 18.1
  Top Layer w0.254: U1.11 42.69,39.88 v1(43.07,40.26) ; v1(47.37,40.26) 47.37,45.21 H3.1
  Bottom Layer w0.254: v1(43.07,40.26) v1(47.37,40.26)
PC5: length 23.3
  Top Layer w0.254: C15.2 17.56,31.33 R33.2 SW11.4 21.71,30.23 27.43,30.23 27.56,30.1 28.78,30.1 28.91,30.23 U1.25
PC6: length 11.8
  Top Layer w0.254: v1(42.29,22.22) 42.29,23.67 42.26,23.7 42.26,24.66 U1.37 ; v1(35.05,21.08) 35.05,20.46 R13.2
  Inner2 w0.254: v1(35.05,21.08) 36.14,22.17 37.96,22.17 38.16,21.97 42.04,21.97 v1(42.29,22.22)
PC7: length 6.6
  Top Layer w0.254: U1.38 42.69,22.65 42.88,22.47 42.88,21.98 42.53,21.64 41.83,21.64 R12.2
PC8: length 5.8
  Top Layer w0.254: U1.39 43.26,24.66 43.26,21.73 45.05,19.94 R11.2
PC9: length 8.9
  Top Layer w0.254: R10.2 48.65,19.77 47.98,20.45 46.23,20.45 45.97,20.7 44.8,20.7 43.69,21.8 U1.40
PC10: length 50.8
  Top Layer w0.254: R45.1 63.36,54.61 U14.4 v1(63.99,54.61) ; U1.51 51.86,27.73 55.07,30.94 55.76,30.94 56.62,30.08 56.62,29.04 56.16,28.58 56.16,27.28 v1(56.77,26.67)
  Bottom Layer w0.254: v1(63.99,54.61) 63.99,52.15 64.02,52.13 64.02,37.72 63.99,37.69 63.99,33.89 63.52,33.42 62.12,33.42 61.92,33.22 61.92,29.54 60.43,28.05 59.2,28.05 58,26.85 56.95,26.85 v1(56.77,26.67)
PC11: length 49.6
  Top Layer w0.254: 63.74,56.26 R44.1 ; 63.74,56.26 63.32,55.84 63.13,55.84 63.04,55.75 62.23,55.75 v1(62.04,55.56) ; 63.74,56.26 U14.3 ; v1(57.02,27.43) 57.02,27.45 56.52,27.95 56.52,28.44 56.86,28.78 56.9,28.78 56.98,28.86 56.98,30.23 56.01,31.19 56.01,31.24 55.94,31.31 54.93,31.31 51.85,28.23 U1.52
  Bottom Layer w0.254: v1(62.04,55.56) 62.04,54.24 60.59,52.79 60.59,51.14 60.95,50.79 60.95,36.86 56.52,32.43 56.52,27.94 v1(57.02,27.43)
PC12: length 49.6
  Top Layer w0.254: 50.55,28.8 51.92,28.8 54.79,31.68 56.08,31.68 57.33,30.43 57.33,28.42 v1(57.1,28.19) ; v1(62.74,57.28) 63.48,57.28 U14.2 59.81,57.78 R43.1
  Bottom Layer w0.254: v1(62.74,57.28) 62.74,52.9 63.66,51.98 63.66,37.87 62.97,37.17 62.92,37.17 62.74,36.99 61.58,36.99 arc(61.39,36.91) 61.3,36.71 59.04,34.45 59.04,30.13 v1(57.1,28.19)
PC15: length 5.9
  Top Layer w0.254: U1.4 46.19,37.19 46.51,37.51 49.83,37.51 50.67,38.35
PD2: length 43.5
  Top Layer w0.254: v1(51.56,29.59) 51.29,29.59 50.93,29.23 U1.54 ; v1(62.84,58.45) 63.45,59.05 ; 63.45,59.05 U14.1 ; 63.45,59.05 R42.1
  Bottom Layer w0.254: v1(62.84,58.45) 62.61,58.22 59.11,58.22 58.93,58.04 58.93,53.67 58.05,52.79 58.05,40.81 58.93,39.93 58.93,36.96 v1(51.56,29.59)
RS_LED: length 24.8
  Top Layer w0.254: v1(69.34,56.9) 69.34,56.53 U14.6 69.36,56.33 69.85,55.84 70.22,55.84 70.57,55.49 70.57,55.12 LED11.1 ; v1(70.93,61.02) 70.6,61.35 R39.1 R40.2 v1(69.96,64.91) ; P1.1 59.97,64.94 v1(61.2,66.18)
  Bottom Layer w0.254: v1(61.2,66.18) 68.69,66.18 v1(69.96,64.91) ; v1(69.34,56.9) 69.34,59.18 70.93,60.77 v1(70.93,61.02)
SEGA: length 22.1
  Top Layer w0.254: R8.2 26.66,21.84 10.91,21.84 LED1.7
SEGB: length 3.2
  Top Layer w0.254: LED1.6 13.57,19.94 R1.1
SEGC: length 16.4
  Top Layer w0.254: LED1.4 9.14,5.72 8,6.86 8,10.28 R2.1
SEGD: length 16.4
  Top Layer w0.254: LED1.2 4.25,6.43 v1(4.25,6.73) ; R3.1 8.64,8.37 v1(8.64,7.87)
  Bottom Layer w0.254: v1(8.64,7.87) 7.49,6.73 v1(4.25,6.73)
SEGDP: length 3.3
  Top Layer w0.254: LED1.5 14.99,5.72 R7.1
SEGE: length 16.7
  Top Layer w0.254: R4.1 10.93,8.51 v1(10.41,8.51) ; v1(2.54,6.86) 2.43,6.74 LED1.1
  Bottom Layer w0.254: v1(2.54,6.86) 2.6,6.86 4.2,8.46 10.36,8.46 v1(10.41,8.51)
SEGF: length 15.6
  Top Layer w0.254: R5.1 v1(14.61,10.67) ; LED1.9 4.94,19.7 v1(5.08,19.56)
  Bottom Layer w0.254: v1(5.08,19.56) 5.72,19.56 v1(14.61,10.67)
SEGG: length 20.5
  Top Layer w0.254: LED1.10 2.4,19.55 v1(2.29,19.43) ; R6.1 v1(14.35,8.51)
  Bottom Layer w0.254: v1(2.29,19.43) 2.29,17.46 11.24,8.51 v1(14.35,8.51)
$1N873: length 6.1
  Top Layer w0.254: U2.1 20.64,19.94 R1.2
$1N1103: length 5.6
  Top Layer w0.254: U2.2 21.67,17.65 R2.2
$1N1142: length 5.5
  Top Layer w0.254: U2.3 17.56,15.79 R3.2
$1N1181: length 5.8
  Top Layer w0.254: U2.4 18.45,14.52 R4.2
$1N1220: length 6.3
  Top Layer w0.254: R5.2 19.6,13.25 U2.5
$1N1259: length 6.7
  Top Layer w0.254: R6.2 20.48,11.98 U2.6
$1N1298: length 6.9
  Top Layer w0.254: R7.2 21.5,10.71 U2.7
$1N1337: length 2.6
  Top Layer w0.254: U2.15 29.93,17.06 R8.1
$1N1938: length 3.1
  Top Layer w0.254: 53.13,19.57 53.13,17.44 LED16.1
$1N1977: length 3.6
  Top Layer w0.254: LED12.2 50.16,18.84 R10.1
$1N2016: length 3.9
  Top Layer w0.254: LED15.1 43.82,18.96 R11.1
$1N2055: length 3.7
  Top Layer w0.254: LED13.1 38.49,18.83 R12.1
$1N2094: length 3.7
  Top Layer w0.254: LED14.1 33.03,18.96 R13.1
$1N15849: length 8.2
  Top Layer w0.254: C17.2 44.32,41.71 X1.1 44.14,41.08 45.19,40.02 U1.6
$1N15856: length 8.1
  Top Layer w0.254: U1.5 45.76,36.3 45.76,40.05 46.54,40.82 X1.3 46.54,43.69 C16.2
$1N47761: length 14.1
  Top Layer w0.254: 65.4,63.89 65.4,64.76 67.58,66.94 R38.1 ; 65.4,63.89 P1.2 ; 65.4,63.89 65.52,63.89 68.06,61.35 R39.2 68.07,60.97 68.07,58.17 68.45,57.78 U14.7
$1N55994: length 1.8
  Top Layer w0.254: R51.1 13.08,65.76 LED9.2
$1N56128: length 1.5
  Top Layer w0.254: LED10.2 48.39,10.67 R52.1
$1N56458: length 1.9
  Top Layer w0.254: R57.1 LED11.2
$1N56501: length 2.2
  Top Layer w0.254: C21.2 C22.2
$1N56861: length 2.6
  Top Layer w0.254: R59.1 30.73,12.19 32.8,12.19 LED8.1
$1N57464: length 1.9
  Top Layer w0.254: R60.2 61.85,31.75 H8.1
$1N58918: length 2.4
  Top Layer w0.254: LED17.1 32.97,6.85 R58.1
$1N63238: length 1.7
  Top Layer w0.254: SW1.3 3.13,45.06 C23.1
$1N63239: length 1.7
  Top Layer w0.254: SW2.3 3.07,38.52 C24.1
$1N63240: length 1.7
  Top Layer w0.254: C25.1 3.07,31.92 SW3.3
$1N63241: length 1.7
  Top Layer w0.254: C26.1 3.07,25.32 SW4.3

## Copper pours and planes (outline as drawn; the poured copper is in the pictures)
GND on Top Layer: -0.25,68.2 71.75,68.2 71.75,0 -0.25,0
GND on Top Layer: -0.38,68.07 71.76,68.07 71.76,0 -0.38,0
GND on Inner1: -5.97,147.57 81.15,147.57 81.15,93.47 -5.97,93.47
(no net) on Top Layer: -0.89,69.21 72.9,69.21 72.9,-0.89 -0.89,-0.89
